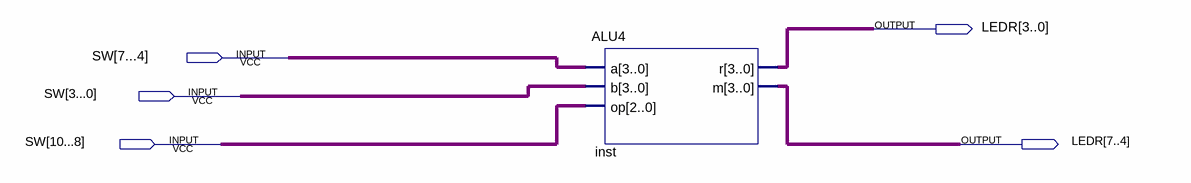
[diagram p0: schematic sheet]
// Quartus schematic ALUDemo.bdf as structural Verilog: 1 symbols, 5 pins
module ALUDemo (
  input  \SW[7...4] ,
  input  \SW[3...0] ,
  input  \SW[10...8] ,
  output [7:0] LEDR
);

  wire [2:0] undriven_3;
  wire [3:0] undriven, undriven_2;

  ALU4 inst (.a(undriven_2), .b(undriven), .op(undriven_3), .r(LEDR[3:0]), .m(LEDR[7:4]));
endmodule
